# Altium project Apogee Detection.PrjPCB (part 2 of 2)

## Sheet Temp_Sensor.SchDoc
size A4
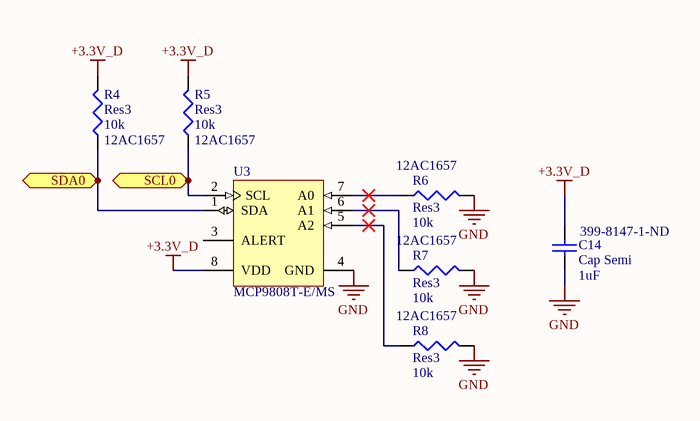
[diagram p4: Temp_Sensor.SchDoc]

### Parts
C14  Cap Semi  value 1uF  Supplier Part Number 1: 399-8147-1-ND  [C1206]
R4  Res3  value 10k  Supplier Part Number 1: 12AC1657  [6-0805_L]
R5  Res3  value 10k  Supplier Part Number 1: 12AC1657  [6-0805_L]
R6  Res3  value 10k  Supplier Part Number 1: 12AC1657  [6-0805_L]
R7  Res3  value 10k  Supplier Part Number 1: 12AC1657  [6-0805_L]
R8  Res3  value 10k  Supplier Part Number 1: 12AC1657  [6-0805_L]
U3  MCP9808T-E/MS  [MCHP-MSOP-MS8_M]

### Ports
SCL0 (bidir), SDA0 (bidir)

### Nets
+3.3V_D: C14.2 R4.2 R5.2 U3.8(VDD)
GND: C14.1 R6.2 R7.2 R8.2 U3.4(GND)
SCL0: R5.1 U3.2(SCL) ; port SCL0
SDA0: R4.1 U3.1(SDA) ; port SDA0
NetR6_1: R6.1 U3.7(A0)
NetR7_1: R7.1 U3.6(A1)
NetR8_1: R8.1 U3.5(A2)

Not connected (* = marked no-connect by the designer): U3 3(ALERT)

### Library data of the parts
C14 = Cap Semi: Multilayer Ceramic Capacitors MLCC - SMD/SMT 50volts 1uF X7R 10%; Manufacturer: KEMET; Manufacturer Part Number: C1206C105K5RACTU; SPN: 732-7692-1-ND; Voltage Rating (DC): 50V; Published: 8-Jun-2000; LatestRevisionDate: 29-May-2009; LatestRevisionNote: IPC-7351 Footprint Added.; PackageReference: C1206; Publisher: Altium Limited; PackageDescription: Chip Capacitor; Supplier 1: Digi-Key; RoHS: Yes; Category: Ceramic Capacitors; Stock 1: 155925; Pricing 1: 1=0.30000, 10=0.20900, 50=0.13940, 100=0.11850, 500=0.08364, 1000=0.07318 (USD); Mount: Surface Mount; Case/Package: 1206; Number of Pins: 2; Case Code (Imperial): 1206; Case Code (Metric): 3216; Dielectric Material: Ceramic; Min Operating Temperature: -55°C; Max Operating Temperature: 125°C; Capacitance: 1uF; Tolerance: 10%; Packaging: Tape and Reel; Dielectric: X7R; Voltage Rating: 50V; Termination: SMD/SMT; Package Quantity: 1; Voltage: 50V; Length: 3.2mm; Height: 1mm; Width: 0.063inch; Depth: 1.6mm; Thickness: 0.043inch; Radiation Hardening: No; REACH SVHC: No SVHC; ComponentLink1URL: https://datasheet.ciiva.com/7730/kem-c1002-x7r-smd-7730086.pdf?src-supplier=Element14; ComponentLink1Description: https://datasheet.ciiva.com/7730/kem-c1002-x7r-smd-7730086.pdf?src-supplier=Element14; ComponentLink2URL: https://datasheet.ciiva.com/6074/kem-c1002-x7r-smd-6074697.pdf?src-supplier=Farnell; ComponentLink2Description: https://datasheet.ciiva.com/6074/kem-c1002-x7r-smd-6074697.pdf?src-supplier=Farnell; ComponentLink3URL: https://datasheet.ciiva.com/22749/1918693-22749725.pdf?src-supplier=Element14; ComponentLink3Description: https://datasheet.ciiva.com/22749/1918693-22749725.pdf?src-supplier=Element14
R4-R8 = Res3: VISHAY BC COMPONENTS   MCT06030C1002FP500   RESISTOR, 0603, 10KOHM, 100mW, 1PER; SPN: RNCP0805FTD10K0CT-ND; Resistance: 10kR; Tolerance: 1%; Temperature Coefficient: 50ppm/°C; Voltage Rating: 75V; Max Power Dissipation: 125mW; Published: 8-Jun-2000; LatestRevisionDate: 29-May-2009; LatestRevisionNote: IPC-7351 Footprint Added.; PackageReference: J1-0603; Publisher: Altium Limited; PackageDescription: Chip Resistor; Supplier 1: Newark; Manufacturer: Vishay; Manufacturer Part Number: MCT06030C1002FP500; RoHS: Yes; Category: Chip SMD Resistors; Stock 1: 224988; Pricing 1: 1=0.02000, 5000=0.01900, 10000=0.01800, 20000=0.01700, 30000=0.01600 (USD); Mount: Surface Mount; Case/Package: 0603; Case Code (Imperial): 0603; Case Code (Metric): 1608; Contact Plating: Tin; Min Operating Temperature: -55°C; Max Operating Temperature: 125°C; Packaging: Tape and Reel; Composition: Thin Film; Power Rating: 100mW; Number of Terminations: 2; Military Standard: Not; Package Quantity: 1; Voltage Rating (DC): 75V; Length: 1.55mm; Height: 0.022inch; Width: 0.8mm; Depth: 0.85mm; Radiation Hardening: No; Lead Free: Lead Free; REACH SVHC: Unknown; ComponentLink1URL: https://datasheet.ciiva.com/7836/mc-pro-7836231.pdf?src-supplier=Element14; ComponentLink1Description: https://datasheet.ciiva.com/7836/mc-pro-7836231.pdf?src-supplier=Element14; ComponentLink2URL: https://datasheet.ciiva.com/2470/mc-pro-2470393.pdf?src-supplier=Digi-Key; ComponentLink2Description: https://datasheet.ciiva.com/2470/mc-pro-2470393.pdf?src-supplier=Digi-Key; ComponentLink3URL: https://datasheet.ciiva.com/48524/mc-pro-48524219.pdf?src-supplier=Avnet; ComponentLink3Description: https://datasheet.ciiva.com/48524/mc-pro-48524219.pdf?src-supplier=Avnet; ComponentLink4URL: https://datasheet.ciiva.com/16452/mc-pro-16452734.pdf?src-supplier=Future+Electronics; ComponentLink4Description: https://datasheet.ciiva.com/16452/mc-pro-16452734.pdf?src-supplier=Future+Electronics; ComponentLink5URL: https://datasheet.ciiva.com/22734/mc-pro-22734095.pdf?src-supplier=Element14; ComponentLink5Description: https://datasheet.ciiva.com/22734/mc-pro-22734095.pdf?src-supplier=Element14; ComponentLink6URL: https://datasheet.ciiva.com/2470/mc-pro-2470394.pdf?src-supplier=Digi-Key; ComponentLink6Description: https://datasheet.ciiva.com/2470/mc-pro-2470394.pdf?src-supplier=Digi-Key; ComponentLink7URL: https://datasheet.ciiva.com/2470/mc-pro-2470395.pdf?src-supplier=Digi-Key; ComponentLink7Description: https://datasheet.ciiva.com/2470/mc-pro-2470395.pdf?src-supplier=Digi-Key; ComponentLink8URL: https://datasheet.ciiva.com/5897/mc-pro-5897803.pdf?src-supplier=Farnell; ComponentLink8Description: https://datasheet.ciiva.com/5897/mc-pro-5897803.pdf?src-supplier=Farnell; ComponentLink9URL: https://datasheet.ciiva.com/16512/mc-pro-16512780.pdf?src-supplier=Avnet+Asia; ComponentLink9Description: https://datasheet.ciiva.com/16512/mc-pro-16512780.pdf?src-supplier=Avnet+Asia; ComponentLink10URL: https://datasheet.ciiva.com/16892/mc-pro-16892989.pdf?src-supplier=Avnet+Europe; ComponentLink10Description: https://datasheet.ciiva.com/16892/mc-pro-16892989.pdf?src-supplier=Avnet+Europe; ComponentLink11URL: https://datasheet.ciiva.com/9112/mc-pro-9112527.pdf?src-supplier=Avnet; ComponentLink11Description: https://datasheet.ciiva.com/9112/mc-pro-9112527.pdf?src-supplier=Avnet
U3 = CMP-0192-00343-1: + / - 0.5 degC Maximum Accuracy Digital Temperature Sensor, 400 uA, 2.7 to 5.5 V, -40 to 125 degC, 8-pin MSOP (MS8), Tape and Reel; Manufacturer: Microchip; PackageVersion: C04-111C; ComponentLink1URL: http://www.microchip.com; ComponentLink2URL: http://ww1.microchip.com/downloads/en/DeviceDoc/25095A.pdf; PackageReference: MSOP-MS8; ComponentLink2Description: Datasheet; DatasheetVersion: Rev. A; ComponentLink1Description: Manufacturer URL; PackageDescription: 8-Lead Plastic Micro Small Outline Package, 3 x 3 mm Body, 0.65 mm Pitch; ComponentLink3Description: Package Specification; ComponentLink3URL: http://www.microchip.com/stellent/groups/techpub_sg/documents/packagingspec/en012702.pdf; PartNumber: MCP9808T-E/MS; ComponentLink4URL: http://www.microchip.com/MCP9808; ComponentLink4Description: Product URL; Mounting Technology: Surface Mount

## Sheet Radio_XBP9X_DMRS_001.SchDoc
size A
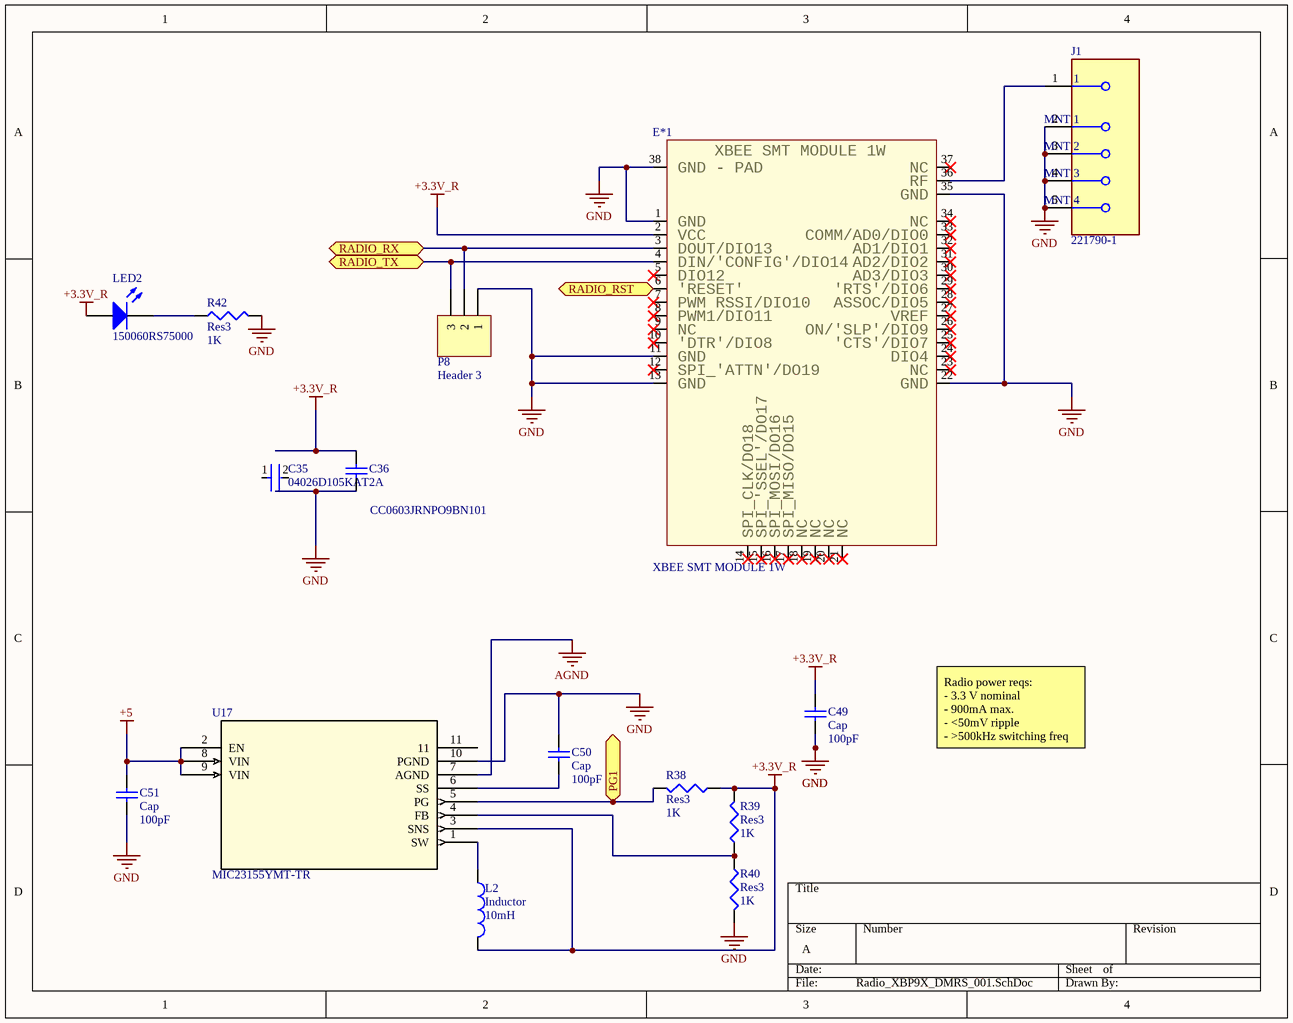
[diagram p5: Radio_XBP9X_DMRS_001.SchDoc]

### Parts
C35  04026D105KAT2A  [FP-0402-L_1_0_1-W_0_5_0_1-MFG]
C36  CC0603JRNPO9BN101  [CAPC1608X90X40ML10T20]
C49  Cap  value 100pF  [RAD-0.3]
C50  Cap  value 100pF  [RAD-0.3]
C51  Cap  value 100pF  [RAD-0.3]
E*1  XBEE SMT MODULE 1W
J1  221790-1  [FP-221790-1-MFG]
L2  Inductor  value 10mH  [0402-A]
LED2  150060RS75000  [0603_A]
P8  Header 3  [HDR1X3]
R38  Res3  value 1K  [J1-0603]
R39  Res3  value 1K  [J1-0603]
R40  Res3  value 1K  [J1-0603]
R42  Res3  value 1K  [J1-0603]
U17  MIC23155YMT-TR  [DFN-10_MCH]

### Ports
PG1 (bidir), RADIO_RST (bidir), RADIO_RX (bidir), RADIO_TX (bidir)

### Nets
+3.3V_R: C36.2 C49.2 E*1.2 L2.2 LED2.2(A) R38.1 R39.2 U17.3(SNS)
+5: C51.2 U17.2(EN) U17.8(VIN) U17.9(VIN)
AGND: U17.7(AGND)
GND: C36.1 C49.1 C50.2 C51.1 E*1.1 E*1.11 E*1.13 E*1.22 E*1.35 E*1.38 J1.2(MNT_1) J1.3(MNT_2) J1.4(MNT_3) J1.5(MNT_4) P8.1 R40.2 R42.2 U17.10(PGND)
PG1: R38.2 U17.5(PG) ; port PG1
RADIO_RST: E*1.6 ; port RADIO_RST
RADIO_RX: E*1.3 P8.2 ; port RADIO_RX
RADIO_TX: E*1.4 P8.3 ; port RADIO_TX
NetC50_1: C50.1 U17.6(SS)
NetE*1_36: E*1.36 J1.1
NetL2_1: L2.1 U17.1(SW)
NetLED2_1: LED2.1(K) R42.1
NetR39_1: R39.1 R40.1 U17.4(FB)

Not connected (* = marked no-connect by the designer): C35 1 2; E*1 5* 7* 8* 9* 10* 12* 14* 15* 16* 17* 18* 19* 20* 21* 23* 24* 25* 26* 27* 28* 29* 30* 31* 32* 33* 34* 37*; U17 11

### Notes on the sheet
- Radio power reqs:
  - 3.3 V nominal
  - 900mA max.
  - <50mV ripple
  - >500kHz switching freq
- (in symbol XBEE SMT MODULE 1W) GND - PAD; NC; RF; GND; VCC; COMM/AD0/DIO0; DOUT/DIO13; AD1/DIO1; DIN/'CONFIG'/DIO14; AD2/DIO2; DIO12; AD3/DIO3; 'RESET'; 'RTS'/DIO6; PWM RSSI/DIO10; ASSOC/DIO5; PWM1/DIO11; VREF; ON/'SLP'/DIO9; 'DTR'/DIO8; 'CTS'/DIO7; DIO4; SPI_'ATTN'/DO19; SPI_CLK/DO18; SPI_'SSEL'/DO17; SPI_MOSI/DO16; SPI_MISO/DO15

### Library data of the parts
C35 = CMP-1034-02113-3: General Purpose Ceramic Capacitor, 0402, 1uF, 10%, X5R, 15%, 6.3V; Tolerance: 10%; Max Operating Temperature: 85°C; Packaging: Tape and Reel; Case Code (Imperial): 0402; Radiation Hardening: No; RoHS Compliant: Yes; Voltage: 6.3V; REACH SVHC: No SVHC; Series: -; Package Quantity: 1; Thickness: 0.022inch; Termination: SMD/SMT; Lead Free: Lead Free; Height: 0.56mm; Mount: Surface Mount; Voltage Rating (DC): 6.3V; Construction: Flat; Min Operating Temperature: -55°C; Capacitance: 1uF; Length: 1mm; Depth: 0.5mm; Voltage Rating: 6.3V; Case Code (Metric): 1005; Contact Plating: Tin; Width: 0.02inch; Case/Package: 0402; Dielectric: X5R
C36 = CMP-2100-03594-1: Chip Capacitor, 100 pF, +/- 5%, 50 V, -55 to 125 degC, 0603 (1608 Metric), RoHS, Tape and Reel; Manufacturer: Yageo; Capacitance: 100pF; Voltage Rating (DC): 50V; Dielectric: C0G; Temperature Coefficient: 30ppm/degC; Insulation Resistance: 100GR; Datasheet Version: Rev. 14, 07/2016; Manufacturer URL: http://www.yageo.com/; Packaging: TapeandReel; Mount: SurfaceMount; RoHSCompliant: True; Package Reference: 0603; Tolerance: 5%; Max Operating Temperature: 125degC; Case Code (Imperial): 0603; Number of Pins: 2; Width: 0.8mm; Case Code (Metric): 1608; Voltage: 50V; REACH SVHC: Unknown; Package Description: 2-Pin Surface Mount Device, Body 1.6 x 0.8 mm; Composition: Ceramic; Lead Free: LeadFree; Min Operating Temperature: -55degC; Radiation Hardening: No; Depth: 0.8mm; Thickness: 0.035inch; Datasheet URL: http://www.yageo.com/documents/recent/UPY-GP_NP0_16V-to-50V_14.pdf; Termination: SMD/SMT; Package Quantity: 1; Length: 1.6mm; Voltage Rating: 50V; Height: 0.8mm; Case/Package: 0603
C49-C51 = Cap: Capacitor; Published: 8-Jun-2000; LatestRevisionDate: 17-Jul-2002; LatestRevisionNote: Re-released for DXP Platform.; PackageReference: RAD-0.3; Publisher: Altium Limited; PackageDescription: Radial Cap, Thru-Hole; 2 Leads; 0.3 in Pin Spacing
J1 = CMP-05166-000001-1: CONN SMA JACK R/A 50 OHM PCB; Manufacturer: TE Connectivity / AMP; Is Female: yes; Impedance: 50Ω; Number Of Contacts: 1; Shielding: true; Voltage Rating: 335V; Frequency: 4GHz; Dielectric Material: Fluoropolymer; Conn Orientation: Right Angle; Octopart: https://octopart.com/2217901-te+connectivity+%2F+amp-3339836; Contact Material: Gold; Temperature: -65°C to +165°C; RoHS: TRUE; Device Class L1: Connectors; Temperature Range Low: -65°C; Mouser Description: RF Connectors / Coaxial Connectors PCB RIGHT ANGLE JACK; Lead Free: Yes; Manufacturer Part Number: 221790-1; Device Class L3: unset; Temperature Range High: +165°C; ComponentLink2URL: https://www.te.com/commerce/DocumentDelivery/DDEController?Action=showdoc&DocId=Customer+Drawing%7F221790%7FB1%7Fpdf%7FEnglish%7FENG_CD_221790_B1.pdf%7F221790-1; Package: 0; ComponentLink2Description: Datasheet; Digikey Description: CONN SMA JACK R/A 50 OHM PCB; Device Class L2: RF / Coaxial Connectors; Category: Conn; Height: 0.38inch; Automotive: No
L2 = Inductor: Code_IEC: 1005; Published: 8-Jun-2000; LatestRevisionDate: 29-May-2009; LatestRevisionNote: IPC-7351 Footprint Added.; PackageReference: 0402-A; Publisher: Altium Limited; PackageDescription: Chip Inductor; Code_JEITA: 0402
LED2 = CMP-1426-00001-1: SMD mono-color Chip LED, WL-SMCW, Red; Manufacturer: Wuerth Elektronik; Color: Red; PackageReference: 0603_A; ComponentLink2URL: http://katalog.we-online.com/led/datasheet/150060RS75000.pdf; ComponentLink1URL: http://www.we-online.com; ComponentLink1Description: Manufacturer URL; ComponentLink2Description: Datasheet; PartNumber: 150060RS75000
P8 = Header 3: Header, 3-Pin; LatestRevisionDate: 17-Jul-2002; LatestRevisionNote: Re-released for DXP Platform.; Publisher: Altium Limited
R38-R40 R42 = Res3: Resistor; Published: 8-Jun-2000; LatestRevisionDate: 29-May-2009; LatestRevisionNote: IPC-7351 Footprint Added.; PackageReference: J1-0603; Publisher: Altium Limited; PackageDescription: Chip Resistor
U17 = MIC23155YMT-TR: No Description Available; Vendor: Microchip; Built_By: EMA_Jessica; SourceLibrary: Microchip_2019-08-23_2; Manufacturer_Part_Number: MIC23155YMT-TR; Copyright: Copyright (C) 2018 Accelerated Designs. All rights reserved; RefDes: RefDes; Type: DEV

## Sheet STIM300IMU.SchDoc
size A4
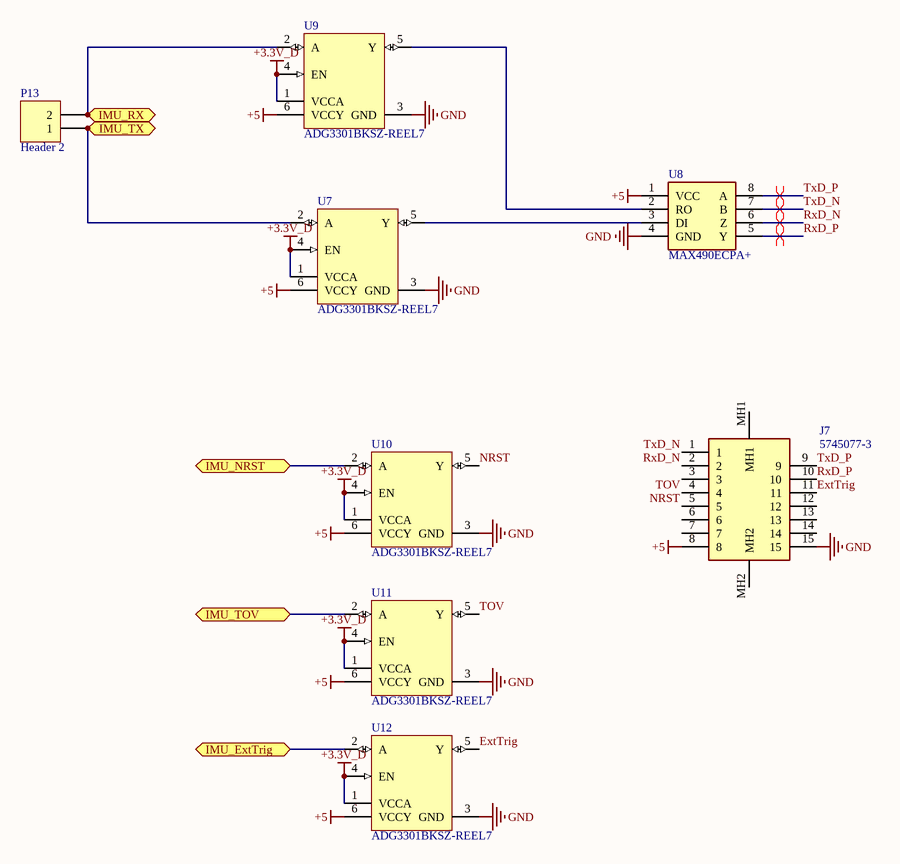
[diagram p6: STIM300IMU.SchDoc]

### Parts
J7  5745077-3  [2301840-1]
P13  Header 2  [HDR1X2]
U7  ADG3301BKSZ-REEL7  [ADI-KS-6_N]
U8  MAX490ECPA+  [DIP762W56P254L938H457Q8N]
U9  ADG3301BKSZ-REEL7  [ADI-KS-6_N]
U10  ADG3301BKSZ-REEL7  [ADI-KS-6_N]
U11  ADG3301BKSZ-REEL7  [ADI-KS-6_N]
U12  ADG3301BKSZ-REEL7  [ADI-KS-6_N]

### Ports
IMU_ExtTrig (bidir), IMU_NRST (bidir), IMU_RX (bidir), IMU_TOV (bidir), IMU_TX (bidir)

### Nets
+3.3V_D: U7.1(VCCA) U7.4(EN) U9.1(VCCA) U9.4(EN) U10.1(VCCA) U10.4(EN) U11.1(VCCA) U11.4(EN) U12.1(VCCA) U12.4(EN)
+5: J7.8 U7.6(VCCY) U8.1(VCC) U9.6(VCCY) U10.6(VCCY) U11.6(VCCY) U12.6(VCCY)
GND: J7.15 U7.3(GND) U8.4(GND) U9.3(GND) U10.3(GND) U11.3(GND) U12.3(GND)
ExtTrig: J7.11 U12.5(Y)
IMU_ExtTrig: U12.2(A) ; port IMU_ExtTrig
IMU_NRST: U10.2(A) ; port IMU_NRST
IMU_RX: P13.2 U9.2(A) ; port IMU_RX
IMU_TOV: U11.2(A) ; port IMU_TOV
IMU_TX: P13.1 U7.2(A) ; port IMU_TX
NRST: J7.5 U10.5(Y)
RxD_N: J7.2 U8.6(Z)
RxD_P: J7.10 U8.5(Y)
TOV: J7.4 U11.5(Y)
TxD_N: J7.1 U8.7(B)
TxD_P: J7.9 U8.8(A)
NetU7_5: U7.5(Y) U8.3(DI)
NetU8_2: U8.2(RO) U9.5(Y)

Not connected (* = marked no-connect by the designer): J7 3 6 7 12 13 14 MH1 MH2

### Layout directives
differential pair: RxD_N, RxD_P, TxD_N, TxD_P

### Library data of the parts
J7 = 5745077-3: Connector; Manufacturer_Name: TE Connectivity; Datasheet Link: https://www.te.com/commerce/DocumentDelivery/DDEController?Action=srchrtrv&DocNm=5745077&DocType=Customer+Drawing&DocLang=English; Height: 12.55mm; Manufacturer_Part_Number: 5745077-3
P13 = Header 2: Header, 2-Pin; LatestRevisionDate: 17-Jul-2002; LatestRevisionNote: Re-released for DXP Platform.; Publisher: Altium Limited
U7 U9-U12 = CMP-0791-00015-1: Low Voltage 1.15 V to 5.5 V, Single-Channel Bidirectional Logic Level Translator, -40 to 85 degC, 6-pin SOT (KS-6), Reel; Manufacturer: Analog Devices; Bus Enable Time (typ): 1us; ComponentLink2URL: http://www.analog.com/static/imported-files/data_sheets/ADG3301.pdf; PackageDescription: 6-Pin Thin Shrink Small Outline Transistor Package, Body 2 x 1.25 mm, Pitch 0.65 mm; PackageReference: KS-6; ComponentLink1Description: Manufacturer URL; DatasheetVersion: Rev. 0; ComponentLink3Description: Package Specification; ComponentLink1URL: http://www.analog.com/en/index.html; ComponentLink3URL: http://www.analog.com/static/imported-files/packages/PKG_PDF/SC70(KS)/KS_6.pdf; Code_JEDEC: MO-203-AB; PartNumber: ADG3301BKSZ-REEL7; Mounting Technology: Surface Mount; ComponentLink2Description: Datasheet; PackageVersion: 072809-A, 07/2009
U8 = MAX490ECPA+: Integrated Circuit; Manufacturer_Name: Maxim Integrated; Datasheet Link: https://www.mouser.in/datasheet/2/256/MAX1487E-MAX491E-1291632.pdf; Height: 4.572mm; Manufacturer_Part_Number: MAX490ECPA+; Mouser Part Number: 700-MAX490ECPA; Mouser Price/Stock: https://www.mouser.co.uk/ProductDetail/Maxim-Integrated/MAX490ECPA%2b?qs=1THa7WoU59FmiTWtxqzJXQ%3D%3D

## Sheet MCU_Power.SchDoc
size A4
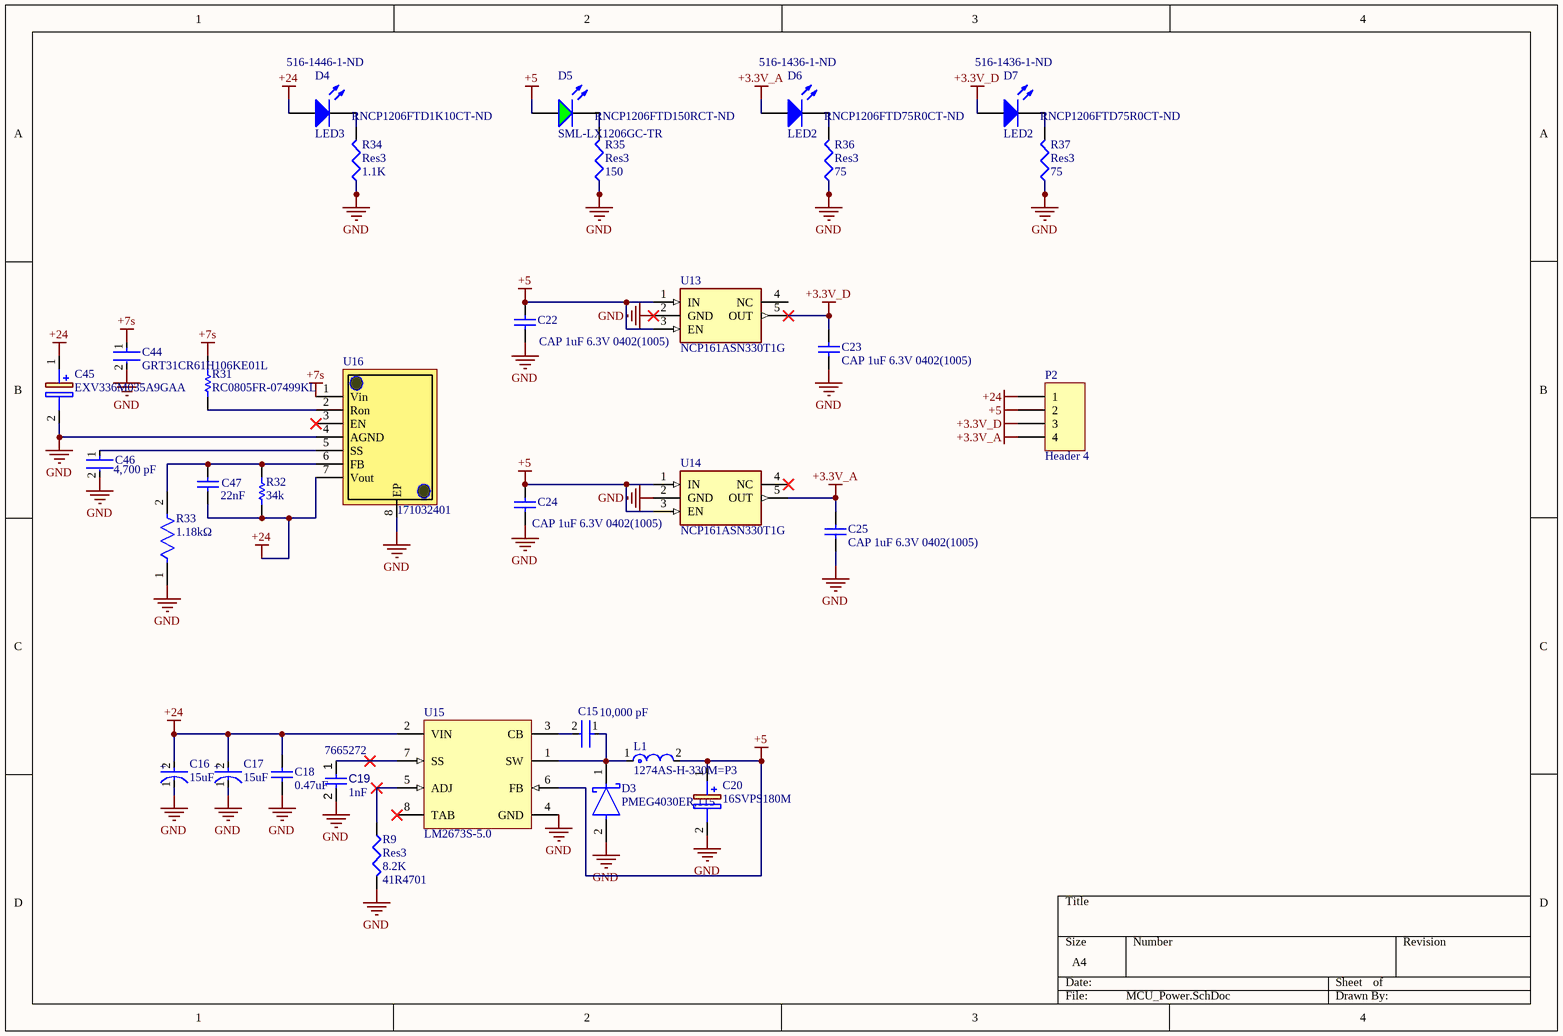
[diagram p7: MCU_Power.SchDoc]

### Parts
C15  value 10,000 pF  [FP-C0805C-DN-MFG]  (hidden comment: C0805C103J5RACTU)
C16  value 15uF  [FP-TPSE-MFG]  (hidden comment: TPSE156M050R0250)
C17  value 15uF  [FP-TPSE-MFG]  (hidden comment: TPSE156M050R0250)
C18  Parameter 1: 0.47uF  [CAPC2013X140X50ML20T25]  (hidden comment: C0805F474K3RACTU)
C19  value 1nF  Supplier Part Number 1: 7665272  [CAPC1608X90X40NL10T20]  (hidden comment: CAP CER 1000PF 50V X7R 0603)
C20  16SVPS180M  [10SVPS150M]
C22  CAP 1uF 6.3V 0402(1005)  [CAPC0402(1005)60_L]
C23  CAP 1uF 6.3V 0402(1005)  [CAPC0402(1005)60_L]
C24  CAP 1uF 6.3V 0402(1005)  [CAPC0402(1005)60_L]
C25  CAP 1uF 6.3V 0402(1005)  [CAPC0402(1005)60_L]
C44  GRT31CR61H106KE01L  [FP-GRT31C-0_2-IPC_A]
C45  EXV336M035A9GAA  [CAPAE660X565N]
C46  Capacitance: 4,700 pF  [FP-C0805C-DN-MFG]  (hidden comment: C0805C472K5RACTU)
C47  22nF  [CAPC2013X145X50NL20T25]
D3  PMEG4030ER,115  [FP-SOD123W-MFG]
D4  LED3  Supplier Part Number 1: 516-1446-1-ND  [C1206]
D5  SML-LX1206GC-TR  [LUMX-SML-LX1206GC-TR_V]
D6  LED2  Supplier Part Number 1: 516-1436-1-ND  [C1206]
D7  LED2  Supplier Part Number 1: 516-1436-1-ND  [C1206]
L1  1274AS-H-330M=P3  [FP-DEM10050C-MFG]
P2  Header 4  [HDR1X4]
R9  Res3  value 8.2K  Supplier Part Number 1: 41R4701  [J1-0603]
R31  RC0805FR-07499KL  [RESC2013X60X35LL10T20]
R32  value 34k  [RESC2013X60X40ML20T25]  (hidden comment: ERA6AEB3402V)
R33  value 1.18kΩ  [FP-RT0805-MFG]  (hidden comment: RT0805BRE071K18L)
R34  Res3  value 1.1K  Supplier Part Number 1: RNCP1206FTD1K10CT-ND  [C1206]
R35  Res3  value 150  Supplier Part Number 1: RNCP1206FTD150RCT-ND  [C1206]
R36  Res3  value 75  Supplier Part Number 1: RNCP1206FTD75R0CT-ND  [C1206]
R37  Res3  value 75  Supplier Part Number 1: RNCP1206FTD75R0CT-ND  [C1206]
U13  NCP161ASN330T1G  [SOT95P280X145-5N]
U14  NCP161ASN330T1G  [SOT95P280X145-5N]
U15  LM2673S-5.0  [KTW0007B_N]
U16  171032401  [7 PIN PFM]

### Nets
+3.3V_A: C25.2 D6.1(A) P2.4 U14.5(OUT)
+3.3V_D: C23.2 D7.1(A) P2.3 U13.5(OUT)
+5: C20.1(+) C22.2 C24.2 D5.1(A) L1.2 P2.2 U13.1(IN) U13.3(EN) U14.1(IN) U14.3(EN) U15.6(FB)
+7s: C44.1 R31.2 U16.1(Vin)
+24: C16.2(A) C17.2(A) C18.1 C45.1(+) C47.1 D4.1(A) P2.1 R32.1 U15.2(VIN) U16.7(Vout)
GND: C16.1(C) C17.1(C) C18.2 C19.2 C20.2(-) C22.1 C23.1 C24.1 C25.1 C44.2 C45.2(-) C46.2 D3.2(A) R9.2 R33.1 R34.1 R35.1 R36.1 R37.1 U13.2(GND) U14.2(GND) U15.4(GND) U16.4(AGND) U16.8(EP)
NetC15_1: C15.1 D3.1(C) L1.1 U15.1(SW)
NetC15_2: C15.2 U15.3(CB)
NetC19_1: C19.1 U15.7(SS)
NetC46_1: C46.1 U16.5(SS)
NetC47_2: C47.2 R32.2 R33.2 U16.6(FB)
NetD4_2: D4.2(K) R34.2
NetD5_2: D5.2(K) R35.2
NetD6_2: D6.2(K) R36.2
NetD7_2: D7.2(K) R37.2
NetR9_1: R9.1 U15.5(ADJ)
NetR31_1: R31.1 U16.2(Ron)

Not connected (* = marked no-connect by the designer): U13 4(NC); U14 4(NC)*; U15 8(TAB)*; U16 3(EN)*

### Notes on the sheet
- (in symbol CMP-04424-000028-1) +

### Library data of the parts
C15 = CMP-2007-00254-2: CAP CER 10000PF 50V X7R 0805; Manufacturer: KEMET; Material: Ceramic; Temperature Coefficient: 30ppm/°C; Tolerance: 0.05; Device Class L1: Passive Components; Temperature: -55°C to +125°C; Lead Free: Yes; ComponentLink2URL: https://content.kemet.com/datasheets/KEM_C1003_C0G_SMD.pdf; Device Class L3: Ceramic Capacitors; Temperature Characteristic: X7R; Temperature Range High: +125°C; Mouser Description: Capacitor; Ceramic; Cap 0.01uF; Tol 5%; Vol-Rtg 50 V; SMT; Case 0805; X7R; TR; ComponentLink2Description: Datasheet; Manufacturer Part Number: C0805C103J5RACTU; Height: 0.88mm; Digikey Description: CAP CER 10000PF 50V X7R 0805; Capacitance: 10,000 pF; Temperature Range Low: -55°C; Device Class L2: Capacitors; Octopart: https://octopart.com/c0805c103j5ractu-kemet-133473; Voltage Rating: 50 V; Category: Cap; RoHS: TRUE; Automotive: No; Package: C0805C-DN; Ipc Land Pattern Name: CAPC200125X78
C16 C17 = CMP-04424-000028-1: CAP TANT 15UF 20% 50V 2917; Manufacturer: AVX Corporation; Ripple Current: 0.812A; Esr: 250mΩ; Leakage Current: 7.5uA; Dissipation Factor: 6%; Material: Tantalum Mn02 solid electrolyte; Life: 1000Hours; Device Class L2: Capacitors; Lead Free: Yes; Temperature Range High: +125°C; ComponentLink2Description: Datasheet; Height: 4.3mm; Temperature: -55°C to +125°C; Octopart: https://octopart.com/tpse156m050r0250-avx-7476984; Mouser Description: Tantalum Capacitors - Solid SMD 15uF 20% 50Volts; Device Class L1: Passive Components; Category: Cap; Digikey Description: CAP TANT 15UF 20% 50V 2917; RoHS: TRUE; Temperature Range Low: -55°C; Voltage Rating: 50V; Capacitance: 15uF; Tolerance: 20%; Automotive: No; Package: TPSE; ComponentLink2URL: http://datasheets.avx.com/TPS.pdf; Device Class L3: Tantalum Capacitors; Manufacturer Part Number: TPSE156M050R0250; Footprint Url: https://www.avx.com/download/software/literature/AVX-Footprint-Library.pdf
C18 = CMP-2007-03309-1: Manufacturer: Kemet; Part Number: C0805F474K3RACTU
C19 = CMP-001-00017-6: 1000 pF ±10% 50V Ceramic Capacitor X7R 0603 (1608 Metric); Manufacturer: Samsung; Manufacturer Part Number: CL10B102KB8NNNC; Tolerance: 10%; Voltage Rating: 50V; Mounting Technology: SM; Max Operating Temperature: 125°C; RoHS Compliant: True; Pins: 2; Capacitor Type: Ceramic; Case/Package: 0603; Min Operating Temperature: -55°C; Supplier 1: RSComponents; RoHS: Yes; Category: Ceramic Capacitors; Stock 1: 164000; Pricing 1: 4000=0.00800, 12000=0.00800, 20000=0.00800, 40000=0.00700, 100000=0.00700 (USD); Mount: Surface Mount; Case Code (Metric): 1608; Case Code (Imperial): 0603; Material: Ceramic; Contact Plating: Tin; Capacitance: 1nF; Dielectric: X7R; Package Quantity: 1; Packaging: Tape and Reel; Voltage: 50V; Voltage Rating (DC): 50V; Series: CL; Construction: Flat; Length: 1.6mm; Width: 0.031inch; Height: 0.8mm; Thickness: 0.035inch; Depth: 0.8mm; Radiation Hardening: No; Lead Free: Lead Free; ComponentLink1URL: https://datasheet.ciiva.com/25805/cl10b102kb8nnnc-25805137.pdf?src-supplier=Digi-Key; ComponentLink1Description: https://datasheet.ciiva.com/25805/cl10b102kb8nnnc-25805137.pdf?src-supplier=Digi-Key; ComponentLink2URL: https://datasheet.ciiva.com/15216/getdatasheetpartid-359690-15216231.pdf?src-supplier=Verical; ComponentLink2Description: https://datasheet.ciiva.com/15216/getdatasheetpartid-359690-15216231.pdf?src-supplier=Verical; ComponentLink3URL: https://datasheet.ciiva.com/29198/458300-da-01-en-vs-kondensator-0603-29198498.pdf?src-supplier=Conrad; ComponentLink3Description: https://datasheet.ciiva.com/29198/458300-da-01-en-vs-kondensator-0603-29198498.pdf?src-supplier=Conrad; ComponentLink4URL: https://datasheet.ciiva.com/16199/cl05b104kq5nnnc-16199064.pdf?src-supplier=Future+Electronics; ComponentLink4Description: https://datasheet.ciiva.com/16199/cl05b104kq5nnnc-16199064.pdf?src-supplier=Future+Electronics; ComponentLink5URL: https://datasheet.ciiva.com/26310/mlcc-catalogdownload2013-eng-26310326.pdf?src-supplier=Distrelec; ComponentLink5Description: https://datasheet.ciiva.com/26310/mlcc-catalogdownload2013-eng-26310326.pdf?src-supplier=Distrelec
C20 = 16SVPS180M: Capacitor Polarised; Manufacturer_Name: Panasonic; Datasheet Link: http://industrial.panasonic.com/cdbs/www-data/pdf/AAB8000/AAB8000C232.pdf; Height: 8mm; Manufacturer_Part_Number: 16SVPS180M; Mouser Part Number: 667-16SVPS180M; Mouser Price/Stock: https://www.mouser.co.uk/ProductDetail/Panasonic/16SVPS180M?qs=r271rpOLewtQLZd4uWya%252Bg%3D%3D; Arrow Part Number: 16SVPS180M; Arrow Price/Stock: https://www.arrow.com/en/products/16svps180m/panasonic
C22-C25 = CMP-1034-02113-1: CAP 1uF 6.3V ±10% 0402 (1005 Metric) Thickness 0.6mm SMD; Case-Metric: 1005; Case-EIA: 0402; Tolerance: Â±10%; Value: 1uF; Technology: SMT; Rated Voltage: 6.3 V; Max Thickness: 0.6 mm
C44 = CMP-06035-000076-2: Multi-Layer Ceramic Capacitor 10uF 50V X5R ±10% 1206 Emboss T/R; Length: 0.126inch; Max Operating Temperature: 85°C; Width: 0.063inch; Ratings: AEC-Q200; Voltage Rating: 50V; Dielectric: X5R; Min Operating Temperature: -55°C; Case Code (Imperial): 1206; Capacitance: 10uF; Case Code (Metric): 3216; Thickness: 0.071inch; Tolerance: 10%; Mount: Surface Mount; Case/Package: 1206; Packaging: Cut Tape; Voltage Rating (DC): 50V
C45 = EXV336M035A9GAA: Capacitor Polarised; Manufacturer_Name: Kemet; Datasheet Link: https://www.kemet.com/specsheet/EXV336M035A9GAA; Height: 5.65mm; Manufacturer_Part_Number: EXV336M035A9GAA; Mouser Part Number: 80-EXV336M035A9GAA; Mouser Price/Stock: https://www.mouser.co.uk/ProductDetail/KEMET/EXV336M035A9GAA/?qs=E9QF1UCAUX6jRtOVEL%2FRng%3D%3D; Arrow Part Number: EXV336M035A9GAA; Arrow Price/Stock: https://www.arrow.com/en/products/exv336m035a9gaa/kemet-corporation
C46 = CMP-03020-025139-1: CAP CER 4700PF 50V X7R 0805; Manufacturer: KEMET; Value: 4,700 pF; Material: Ceramic; Tolerance: 0.1; Temperature Coefficient: 30ppm/°C; Temperature Characteristic: X7R; Manufacturer Part Number: C0805C472K5RACTU; Temperature Range Low: -55°C; Device Class L1: Passive Components; Lead Free: Yes; Category: Cap; ComponentLink2Description: Datasheet; ComponentLink2URL: https://content.kemet.com/datasheets/KEM_C1003_C0G_SMD.pdf; Device Class L3: Ceramic Capacitors; Digikey Description: CAP CER 4700PF 50V X7R 0805; RoHS: TRUE; Temperature Range High: +125°C; Voltage Rating: 50 V; Mouser Description: Cap Ceramic 0.0047uF 50V X7R 10% SMD 0805 125°C Paper T/R; Octopart: https://octopart.com/c0805c472k5ractu-kemet-86501; Automotive: No; Package: C0805C-DN; Height: 0.88mm; Device Class L2: Capacitors; Temperature: -55°C to +125°C; Ipc Land Pattern Name: CAPC200125X78
C47 = CMP-2007-01055-1: Part Number: C0805C223K1RACAUTO; Manufacturer: Kemet
D3 = CMP-14398-000026-1: DIODE SCHOTTKY 40V 3A SOD123W; RoHS Compliant: Yes
D4 = LED3: LED BLUE DIFFUSED CHIP SMD; Manufacturer: Broadcom Avago; Manufacturer Part Number: HSMN-C150; Lens Color: White; Viewing Angle: 170°; Luminous Intensity: 35mcd; Forward Voltage: 3.3V; Lens Style: Diffused,Colorless,Rectangular; Dominant Wavelength: 470nm; Test Current: 20mA; Wavelength: 468nm; Power Rating: 78mW; Number of Elements: 1; Reverse Voltage: 5V; Published: 8-Jun-2000; LatestRevisionDate: 17-Dec-2003; LatestRevisionNote: PCB Footprint replaced.; DatasheetVersion: 16-Apr-2002; PackageVersion: 16-Apr-2002; PackageReference: 3.5X2.8X1.9; Publisher: Altium Limited; PackageDescription: SM LED; 2 C-Bend Leads; Body 3.5 x 2.8 x 1.9 mm, inc leads (LxWxH typ); Supplier 1: Digi-Key; RoHS: Yes; Category: LEDs; Stock 1: 6063; Pricing 1: 1=1.00000, 10=0.77800, 100=0.50000, 500=0.42218, 1000=0.33330 (USD); Mount: Surface Mount; Case/Package: 1206; Number of Pins: 2; Color: Blue; Case Code (Metric): 3216; Case Code (Imperial): 1206; Min Operating Temperature: -40°C; Max Operating Temperature: 85°C; Packaging: Tape and Reel; Lens Transparency: Diffused; Forward Current: 20mA; Package Quantity: 1; Illumination Color: Blue; Power Dissipation: 78mW; Number of LEDs: 1; Length: 3.2mm; Height: 1.1mm; Width: 1.6mm; Depth: 1.6mm; Radiation Hardening: No; Lead Free: Lead Free; ComponentLink1URL: https://datasheet.ciiva.com/11773/0900766b804a6539-11773988.pdf?src-supplier=RSComponents; ComponentLink1Description: https://datasheet.ciiva.com/11773/0900766b804a6539-11773988.pdf?src-supplier=RSComponents; ComponentLink2URL: https://datasheet.ciiva.com/15117/getdatasheetpartid-128275-15117643.pdf?src-supplier=Verical; ComponentLink2Description: https://datasheet.ciiva.com/15117/getdatasheetpartid-128275-15117643.pdf?src-supplier=Verical; ComponentLink3URL: https://datasheet.ciiva.com/4688/v02-0592en-13727-4688526.pdf?src-supplier=Mouser; ComponentLink3Description: https://datasheet.ciiva.com/4688/v02-0592en-13727-4688526.pdf?src-supplier=Mouser
D5 = CMP-2000-07122-1: Green Led, Water Clear Lens, 10 mcd, 565 nm, 2.2 V, -40 to 85 degC, 2-Pin SMD, RoHS, Tape and Reel; Manufacturer: Lumex; Number of LEDs: 1; Type: Uni-Color; Viewing Angle: 160; Pin_Count: 2; Intensity: 10mcd; Reverse Voltage: 5(Min)V; COO: CN; LED Material: GaP; Peak Wavelength: 565nm; Lens Appearance: ColorlessNonDiffused; Datasheet Version: Rev. J, 04/2011; Package Description: 2-Pin Surface Mount Device, Body 3.2 x 1.6 mm; Part No: SML-LX1206GC-TR; Lens Dimensions: 2x1.6x0.5mm; Dimension: 3.2x1.6x1.1mm; Color: Green; Supplier: Lumex; Supplier Standard Pack: 3,000; Manufacturer URL: http://www.lumexinstruments.com/; Dominant Wavelength: N/A; ECCN: EAR99; Datasheet URL: http://www.mouser.com/ds/2/244/SML-LX1206GC-TR-112732.pdf; HTS: 8541402000; Mounting: SurfaceMount; Package Reference: SML-LX1206GC-TR; Family: SML-LX1206GC; Packaging: TapeandReel; RoHS: Yes; Operating Temperature: -40to85C; Supplier_Package: SMD; Mounting Technology: SurfaceMount
D6 D7 = LED2: LED, BLUE, 55MCD, 473NM; LED Colour:Blue; Bulb Size:-; Wavelength Typ:473nm; Forward Voltage:3.4V; Forward Current If:20mA; Luminous Intensity:55mcd; LED Mounting:SMD; Lens Shape:Rectangular; Viewing Angle:140 ; Packaging:Cut Tape; ;RoHS Compliant: Yes; Manufacturer: Broadcom Avago; Manufacturer Part Number: HSMR-C150; Lens Color: White; Lens Style: Rectangular,Diffused,Colorless; Viewing Angle: 140°; Forward Voltage: 3.4V; Forward Current: 20mA; Lens Transparency: Diffused; Power Dissipation: 78mW; Voltage Rating (DC): 3.9V; Number of Elements: 1; Reverse Voltage: 5V; Published: 8-Jun-2000; LatestRevisionDate: 17-Jul-2002; LatestRevisionNote: Re-released for DXP Platform.; PackageVersion: Feb-2002; PackageReference: 3.2X1.6X1.1; Publisher: Altium Limited; PackageDescription: SM LED; 2 Flat Leads; Supplier 1: Digi-Key; RoHS: Yes; Category: LEDs; Stock 1: 16212; Pricing 1: 1=0.82000, 10=0.63600, 100=0.40910, 500=0.34542, 1000=0.27270 (USD); Mount: Surface Mount; Case/Package: 1206; Number of Pins: 2; Color: Blue; Case Code (Metric): 3216; Case Code (Imperial): 1206; Min Operating Temperature: -40°C; Max Operating Temperature: 85°C; Luminous Intensity: 55mcd; Packaging: Tape and Reel; Wavelength: 473nm; Dominant Wavelength: 473nm; Test Current: 20mA; Package Quantity: 1; Illumination Color: Blue; Power Rating: 78mW; Number of LEDs: 1; Max Power Dissipation: 78mW; Length: 3.2mm; Height: 1.1mm; Width: 1.6mm; Depth: 1.6mm; Radiation Hardening: No; REACH SVHC: No SVHC; Lead Free: Lead Free
L1 = CMP-06042-015462-1: Shielded Wirewound Inductor 33uH 20% 2500mA 0.0936Ω SMD; Saturation Current: 3.5A; Core Material: Ferrite; Current Rating: 2.5A; Test Frequency: 100kHz; DC Resistance (DCR): 93.6mR; Inductance: 33uH; Mount: Surface Mount; Height - Seated (Max): 0.197inch; Length: 0.394inch; Shielding: Shielded; Resistor Type: Wirewound; Case/Package: SMD/SMT; Max DC Current: 2.5A; Width: 0.394inch; Number of Pins: 2; Tolerance: 20%; Packaging: Tape and Reel
P2 = Header 4: Header, 4-Pin; LatestRevisionDate: 17-Jul-2002; LatestRevisionNote: Re-released for DXP Platform.; Publisher: Altium Limited
R9 = Res3: Res Thick Film 0603 8.2K Ohm 1% 0.33W(1/3W) ±100ppm/°C Pad SMD Automotive T/R; Manufacturer: Vishay; Manufacturer Part Number: CRCW06038K20FKEAHP; Resistance: 8.2kR; Power Rating: 250mW; Voltage Rating: 75V; Published: 8-Jun-2000; LatestRevisionDate: 29-May-2009; LatestRevisionNote: IPC-7351 Footprint Added.; PackageReference: J1-0603; Publisher: Altium Limited; PackageDescription: Chip Resistor; Supplier 1: Newark; RoHS: Yes; Category: Chip SMD Resistors; Stock 1: 1560; Pricing 1: 1=0.15000, 10=0.13000, 25=0.10600, 50=0.08200, 100=0.05800, 250=0.05300 (USD); Mount: Surface Mount; Case/Package: 0603; Contact Plating: Tin; Case Code (Metric): 1608; Case Code (Imperial): 0603; Min Operating Temperature: -55°C; Max Operating Temperature: 155°C; Tolerance: 1%; Resistor Type: Thick Film; Temperature Coefficient: 100ppm/°C; Package Quantity: 5000; Packaging: Tape and Reel; Number of Terminations: 2; Termination: SMD/SMT; Max Power Dissipation: 250mW; Voltage Rating (DC): 75V; Features: Automotive AEC-Q200; Series: CRCW-HP; Resistance Tolerance: 1%; Construction: Rectangular; Technology: THICK FILM; Length: 1.6mm; Width: 0.033inch; Height: 0.022inch; Depth: 0.85mm; Radiation Hardening: No; REACH SVHC: Unknown; Military Standard: Not; Lead Free: Lead Free; RoHS Compliant: Yes; ComponentLink1URL: https://datasheet.ciiva.com/2527/crcwhpe3-2527252.pdf?src-supplier=Digi-Key; ComponentLink1Description: https://datasheet.ciiva.com/2527/crcwhpe3-2527252.pdf?src-supplier=Digi-Key; ComponentLink2URL: https://datasheet.ciiva.com/2527/crcwhpe3-2527253.pdf?src-supplier=Digi-Key; ComponentLink2Description: https://datasheet.ciiva.com/2527/crcwhpe3-2527253.pdf?src-supplier=Digi-Key; ComponentLink3URL: https://datasheet.ciiva.com/2527/crcwhpe3-2527254.pdf?src-supplier=Digi-Key; ComponentLink3Description: https://datasheet.ciiva.com/2527/crcwhpe3-2527254.pdf?src-supplier=Digi-Key; ComponentLink4URL: https://datasheet.ciiva.com/7841/424479-7841625.pdf?src-supplier=Element14; ComponentLink4Description: https://datasheet.ciiva.com/7841/424479-7841625.pdf?src-supplier=Element14; ComponentLink5URL: https://datasheet.ciiva.com/7841/424479-7841626.pdf?src-supplier=Element14; ComponentLink5Description: https://datasheet.ciiva.com/7841/424479-7841626.pdf?src-supplier=Element14; ComponentLink6URL: https://datasheet.ciiva.com/16883/crcwhpe3-16883528.pdf?src-supplier=Avnet+Europe; ComponentLink6Description: https://datasheet.ciiva.com/16883/crcwhpe3-16883528.pdf?src-supplier=Avnet+Europe
R31 = CMP-2001-01165-1: Manufacturer: Yageo; Part Number: RC0805FR-07499KL
R32 = CMP-2001-00803-1: Manufacturer: Panasonic; Part Number: ERA6AEB3402V
R33 = CMP-03412-010286-1: RES SMD 1.18K OHM 0.1% 1/8W 0805; Manufacturer: Yageo; Temperature Coefficient: 50 ppm/°C; Voltage Rating: 150V; Power Rating: 0.125W; Tolerance: 0.0025; Lead Free: Yes; Manufacturer Part Number: RT0805BRE071K18L; Temperature Range Low: -55°C; Device Class L3: Chip SMD Resistors; RoHS: TRUE; Temperature: -55°C to +155°C; Ipc Land Pattern Name: RESC200125X50; Device Class L2: Resistors; ComponentLink2Description: Datasheet; Automotive: No; Digikey Description: RES SMD 1.18K OHM 0.1% 1/8W 0805; Category: Res; ComponentLink2URL: http://www.yageo.com/documents/recent/PYu-RT_1-to-0.01_RoHS_L_9.pdf; Series: RT; Package: RT0805; Device Class L1: Passive Components; Octopart: https://octopart.com/rt0805bre071k18l-yageo-1175281; Footprint Url: http://www.yageo.com/exep/pages/download/literatures/PYu-R_Mount_10.pdf; Composition: Thin Film; Height: 0.6mm; Resistance: 1.18KΩ; Temperature Range High: +155°C
R34 = Res3: RES SMD 1.1K OHM 1% 1/2W 1206; Manufacturer: Stackpole Electronics; Manufacturer Part Number: RNCP1206FTD1K10; Resistance: 1.1kR; Max Power Dissipation: 500mW; Temperature Coefficient: 100ppm/°C; Published: 8-Jun-2000; LatestRevisionDate: 29-May-2009; LatestRevisionNote: IPC-7351 Footprint Added.; PackageReference: J1-0603; Publisher: Altium Limited; PackageDescription: Chip Resistor; Supplier 1: Digi-Key; RoHS: Yes; Category: Chip SMD Resistors; Stock 1: 17664; Pricing 1: 1=0.10000, 10=0.08100, 100=0.03100, 1000=0.01364, 2500=0.01178 (USD); Mount: Surface Mount; Case/Package: 1206; Case Code (Metric): 3216; Case Code (Imperial): 1206; Contact Plating: Tin; Min Operating Temperature: -55°C; Max Operating Temperature: 155°C; Resistor Type: Thin Film; Number of Terminations: 2; Features: Moisture Resistant,Anti-Sulfur; Tolerance: 1%; Packaging: Tape and Reel; Length: 0.122inch; Height: 0.024inch; Width: 0.059inch; Radiation Hardening: No; ComponentLink1URL: https://www.seielect.com/catalog/SEI-Packaging.pdf?src-supplier=Digi-Key; ComponentLink1Description: https://www.seielect.com/catalog/SEI-Packaging.pdf?src-supplier=Digi-Key; ComponentLink2URL: http://www.seielect.com/Catalog/SEI-rncp.pdf?src-supplier=Digi-Key; ComponentLink2Description: http://www.seielect.com/Catalog/SEI-rncp.pdf?src-supplier=Digi-Key; ComponentLink3URL: http://www.seielect.com/Catalog/SEI-RNCP.pdf?src-supplier=Avnet; ComponentLink3Description: http://www.seielect.com/Catalog/SEI-RNCP.pdf?src-supplier=Avnet
R35 = Res3: RES SMD 150 OHM 1% 1/2W 1206; Manufacturer: Stackpole Electronics; Manufacturer Part Number: RNCP1206FTD150R; Resistance: 150R; Max Power Dissipation: 500mW; Temperature Coefficient: 100ppm/°C; Published: 8-Jun-2000; LatestRevisionDate: 29-May-2009; LatestRevisionNote: IPC-7351 Footprint Added.; PackageReference: J1-0603; Publisher: Altium Limited; PackageDescription: Chip Resistor; Supplier 1: Digi-Key; RoHS: Yes; Category: Chip SMD Resistors; Stock 1: 93897; Pricing 1: 1=0.10000, 10=0.08100, 100=0.03100, 1000=0.01364, 2500=0.01178 (USD); Mount: Surface Mount; Case/Package: 1206; Case Code (Metric): 3216; Case Code (Imperial): 1206; Min Operating Temperature: -55°C; Max Operating Temperature: 155°C; Resistor Type: Thin Film; Number of Terminations: 2; Features: Moisture Resistant,Anti-Sulfur; Tolerance: 1%; Packaging: Tape and Reel; Length: 0.122inch; Height: 0.024inch; Width: 0.059inch; Lead Free: Lead Free; ComponentLink1URL: https://www.seielect.com/Catalog/SEI-rncp.pdf?src-supplier=Avnet; ComponentLink1Description: https://www.seielect.com/Catalog/SEI-rncp.pdf?src-supplier=Avnet; ComponentLink2URL: http://www.seielect.com/Catalog/SEI-rncp.pdf?src-supplier=Digi-Key; ComponentLink2Description: http://www.seielect.com/Catalog/SEI-rncp.pdf?src-supplier=Digi-Key; ComponentLink3URL: https://www.seielect.com/catalog/SEI-Packaging.pdf?src-supplier=Digi-Key; ComponentLink3Description: https://www.seielect.com/catalog/SEI-Packaging.pdf?src-supplier=Digi-Key
R36 R37 = Res3: RES 75 OHM 1% 1/2W 1206; Manufacturer: Stackpole Electronics; Manufacturer Part Number: RNCP1206FTD75R0; Resistance: 75R; Max Power Dissipation: 500mW; Temperature Coefficient: 100ppm/°C; Published: 8-Jun-2000; LatestRevisionDate: 29-May-2009; LatestRevisionNote: IPC-7351 Footprint Added.; PackageReference: J1-0603; Publisher: Altium Limited; PackageDescription: Chip Resistor; Supplier 1: Digi-Key; RoHS: Yes; Category: Chip SMD Resistors; Stock 1: 43503; Pricing 1: 1=0.10000, 10=0.08100, 100=0.03100, 1000=0.01364, 2500=0.01178 (USD); Mount: Surface Mount; Case/Package: 1206; Case Code (Metric): 3216; Case Code (Imperial): 1206; Min Operating Temperature: -55°C; Max Operating Temperature: 155°C; Packaging: Tape and Reel; Resistor Type: Thin Film; Number of Terminations: 2; Tolerance: 1%; Features: Moisture Resistant,Anti-Sulfur; Length: 0.122inch; Height: 0.024inch; Width: 0.059inch; ComponentLink1URL: https://www.seielect.com/catalog/SEI-Packaging.pdf?src-supplier=Digi-Key; ComponentLink1Description: https://www.seielect.com/catalog/SEI-Packaging.pdf?src-supplier=Digi-Key; ComponentLink2URL: https://www.seielect.com/Catalog/SEI-rncp.pdf?src-supplier=Digi-Key; ComponentLink2Description: https://www.seielect.com/Catalog/SEI-rncp.pdf?src-supplier=Digi-Key; ComponentLink3URL: http://www.seielect.com/Catalog/SEI-rncp.pdf?src-supplier=Digi-Key; ComponentLink3Description: http://www.seielect.com/Catalog/SEI-rncp.pdf?src-supplier=Digi-Key
U13 U14 = NCP161ASN330T1G: Power Supply; Manufacturer_Name: ON Semiconductor; Datasheet Link: https://componentsearchengine.com/Datasheets/2/NCP161ASN330T1G.pdf; Height: 1.45mm; Manufacturer_Part_Number: NCP161ASN330T1G; Mouser Part Number: 863-NCP161ASN330T1G; Mouser Price/Stock: https://www.mouser.co.uk/ProductDetail/onsemi/NCP161ASN330T1G?qs=vLWxofP3U2ze5zA%252BHmAd3w%3D%3D; Arrow Part Number: NCP161ASN330T1G; Arrow Price/Stock: https://www.arrow.com/en/products/ncp161asn330t1g/on-semiconductor
U15 = CMP-0069-00173-3: 3A Step-Down Voltage Regulator with Adjustable Current Limit, 7-pin TO-263; Manufacturer: Texas Instruments; PackageTopMarking: NSUZXYTTE#*LM2673*S-5.0; PowerWise: N; CompType: Switcher; PackageDescription: TO-263, Molded, .400 x .390 x .180in Body, 7 Lead, .050in Pitch, Surface Mount; ComponentLink1Description: Datasheet URL; RoHS: N; Code_JEDEC: MO-169-AC; PackageReference: KTW0007B; ComponentLink1URL: http://www.ti.com/general/docs/lit/getliterature.tsp?genericPartNumber=LM2673&fileType=pdf; PinCount: 7
U16 = CMP-1496-00005-1: MagI³C-VDRM Variable Step Down Regulator Module WE-VDRM , Ui=6-42V; Manufacturer: Wuerth Elektronik; Ui: 6-42 V; ComponentLink1Description: Manufacturer URL; ComponentLink2Description: Datasheet; ComponentLink1URL: http://www.we-online.com; ComponentLink2URL: http://katalog-live.we-online.de/pm/datasheet/171032401.pdf; PartNumber: 171032401; PackageReference: 7 PIN PFM

## Sheet GPS.SchDoc
size A4
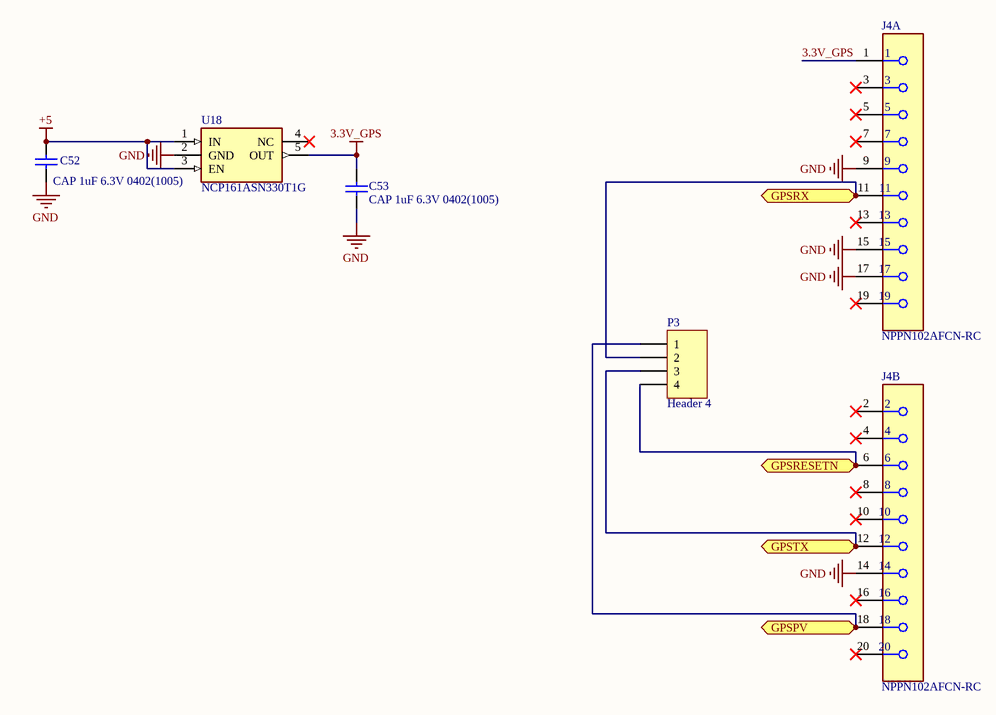
[diagram p8: GPS.SchDoc]

### Parts
C52  CAP 1uF 6.3V 0402(1005)  [CAPC0402(1005)60_L]
C53  CAP 1uF 6.3V 0402(1005)  [CAPC0402(1005)60_L]
J4  NPPN102AFCN-RC  [FP-NPPN102AFCN-RC-MFG]  (parts A,B of 2)
P3  Header 4  [HDR1X4]
U18  NCP161ASN330T1G  [SOT95P280X145-5N]

### Ports
GPSPV (bidir), GPSRESETN (bidir), GPSRX (bidir), GPSTX (bidir)

### Nets
3.3V_GPS: C53.2 J4.1 U18.5(OUT)
+5: C52.2 U18.1(IN) U18.3(EN)
GND: C52.1 C53.1 J4.9 J4.14 J4.15 J4.17 U18.2(GND)
GPSPV: J4.18 P3.1 ; port GPSPV
GPSRESETN: J4.6 P3.4 ; port GPSRESETN
GPSRX: J4.11 P3.2 ; port GPSRX
GPSTX: J4.12 P3.3 ; port GPSTX

Not connected (* = marked no-connect by the designer): J4 2* 3* 4* 5* 7* 8* 10* 13* 16* 19* 20*; U18 4(NC)*

### Library data of the parts
C52 C53 = CMP-1034-02113-1: as C22 on sheet MCU_Power; Value: 1uF; Technology: SMT; Rated Voltage: 6.3 V; Max Thickness: 0.6 mm
J4 = CMP-25680-000029-1: CONN HDR 20POS 0.079 GOLD PCB; Connector Type: Header; Row Spacing: 0.079inch; Number of Positions: 20; Termination: Solder; Contact Plating: Gold; Number of Rows: 2; Packaging: Bulk; Pitch: 0.079inch; Lead Free: Lead Free; Mount: Through Hole; Package Quantity: 1000; Color: Black
P3 = Header 4: Header, 4-Pin; LatestRevisionDate: 17-Jul-2002; LatestRevisionNote: Re-released for DXP Platform.; Publisher: Altium Limited
U18 = NCP161ASN330T1G: as U13 on sheet MCU_Power; Datasheet Link: https://componentsearchengine.com/Datasheets/2/NCP161ASN330T1G.pdf; Height: 1.45mm; Manufacturer_Part_Number: NCP161ASN330T1G; Mouser Part Number: 863-NCP161ASN330T1G; Mouser Price/Stock: https://www.mouser.co.uk/ProductDetail/onsemi/NCP161ASN330T1G?qs=vLWxofP3U2ze5zA%252BHmAd3w%3D%3D; Arrow Part Number: NCP161ASN330T1G; Arrow Price/Stock: https://www.arrow.com/en/products/ncp161asn330t1g/on-semiconductor

## Nets that join several sheets
+3.3V_A: MCU (C2.2 FB1.2 R1.2 U2.31), MCU_Power (C25.2 D6.1 P2.4 U14.5)
+3.3V_D: MCU (26 pins), CANbus (C32.2), isoSPI_to_SPI (7 pins), Temp_Sensor (C14.2 R4.2 R5.2 U3.8), STIM300IMU (10 pins), MCU_Power (C23.2 D7.1 P2.3 U13.5)
+5: MCU (D8.2), CANbus (C30.2 C31.2 U6_A.3 U6_B.3), Radio_XBP9X_DMRS_001 (C51.2 U17.2 U17.8 U17.9), STIM300IMU (7 pins), MCU_Power (11 pins), GPS (C52.2 U18.1 U18.3)
+7s: CANbus (6 pins), isoSPI_to_SPI (J5.4 J5.5 J5.9), MCU_Power (C44.1 R31.2 U16.1)
AGND: MCU (6 pins), Radio_XBP9X_DMRS_001 (U17.7)
GND: MCU (42 pins), CANbus (19 pins), isoSPI_to_SPI (9 pins), Temp_Sensor (5 pins), Radio_XBP9X_DMRS_001 (18 pins), STIM300IMU (7 pins), MCU_Power (24 pins), GPS (7 pins)
CAN1_RX: MCU (U2.46), CANbus (P11.2 U6_A.4)
CAN1_STBN: MCU (U2.47), CANbus (U6_A.5)
CAN1_TX: MCU (U2.45), CANbus (P11.1 U6_A.1)
CAN2_RX: MCU (U2.65), CANbus (P12.2 U6_B.4)
CAN2_STBN: MCU (U2.63), CANbus (U6_B.5)
CAN2_TX: MCU (U2.64), CANbus (P12.1 U6_B.1)
CS0b: MCU (U2.106), isoSPI_to_SPI (P1.6 U5.5)
GPSPV: MCU (U2.97), GPS (J4.18 P3.1)
GPSRESETN: MCU (U2.98), GPS (J4.6 P3.4)
GPSRX: MCU (U2.92), GPS (J4.11 P3.2)
GPSTX: MCU (U2.91), GPS (J4.12 P3.3)
IMU_ExtTrig: MCU (U2.67), STIM300IMU (U12.2)
IMU_NRST: MCU (U2.127), STIM300IMU (U10.2)
IMU_RX: MCU (U2.95), STIM300IMU (P13.2 U9.2)
IMU_TOV: MCU (U2.66), STIM300IMU (U11.2)
IMU_TX: MCU (U2.96), STIM300IMU (P13.1 U7.2)
MISO0: MCU (U2.112), isoSPI_to_SPI (P1.5 R25.2 U5.3)
MOSI0: MCU (U2.111), isoSPI_to_SPI (P1.4 U5.2)
PG1: MCU (U2.90), Radio_XBP9X_DMRS_001 (R38.2 U17.5)
RADIO_RST: MCU (U2.125), Radio_XBP9X_DMRS_001 (E*1.6)
RADIO_RX: MCU (U2.123), Radio_XBP9X_DMRS_001 (E*1.3 P8.2)
RADIO_TX: MCU (U2.124), Radio_XBP9X_DMRS_001 (E*1.4 P8.3)
SCK0: MCU (U2.110), isoSPI_to_SPI (P1.3 U5.4)
SCL0: MCU (U2.83), Temp_Sensor (R5.1 U3.2)
SDA0: MCU (U2.84), Temp_Sensor (R4.1 U3.1)